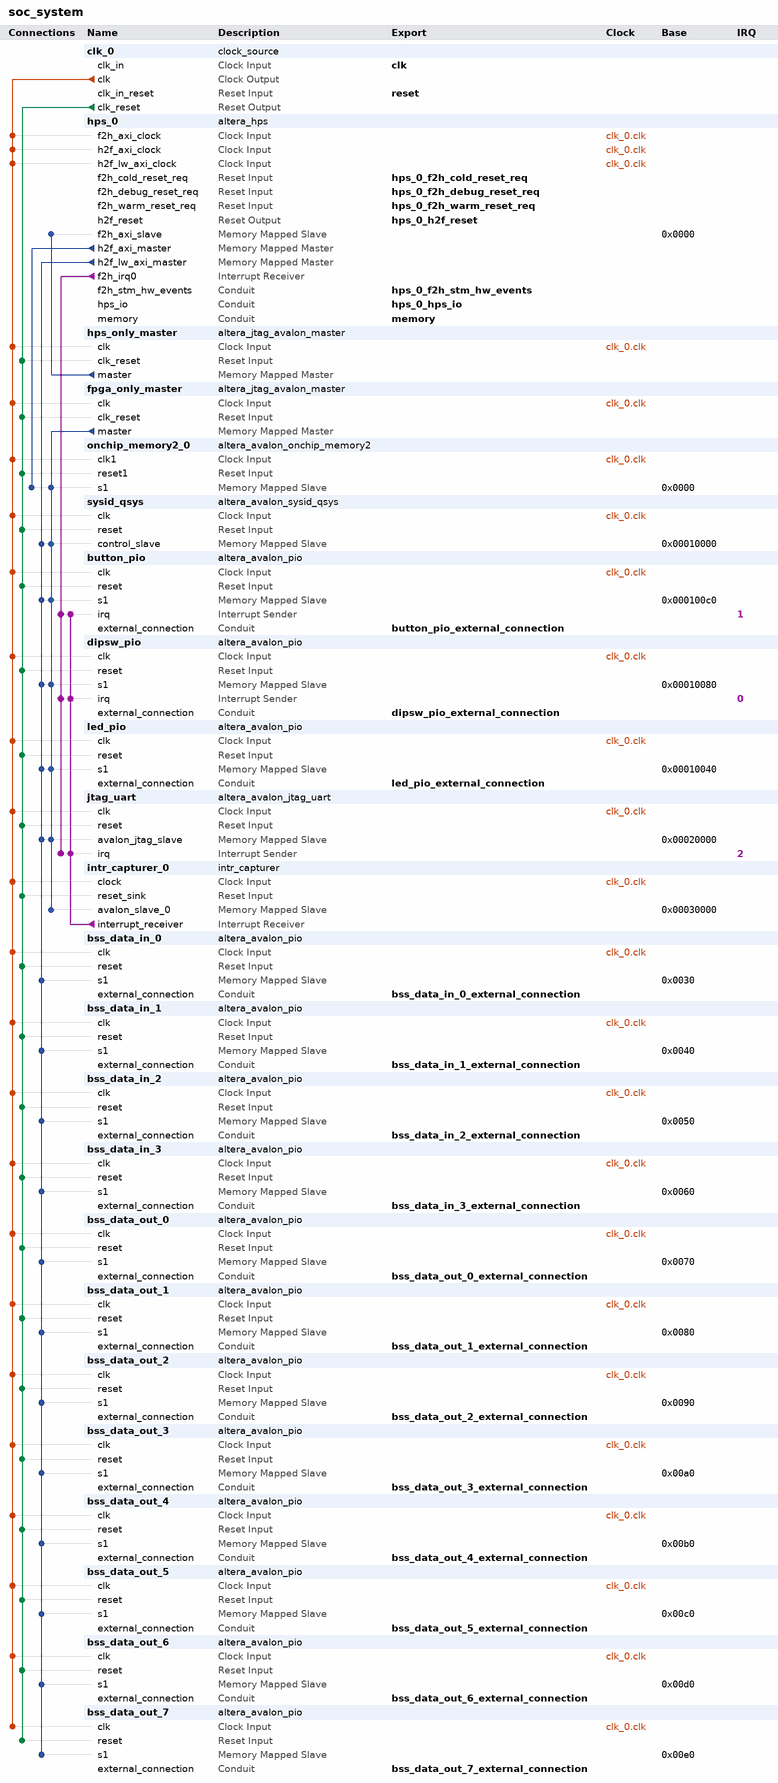
[diagram p0: system contents]
# Platform Designer (Qsys) system soc_system, Cyclone V 5CSEMA4U23C6
# Parameters at their usual value, and those the tool derives, are not listed.
package require -exact qsys 15.1
create_system soc_system
set_project_property DEVICE_FAMILY {Cyclone V}
set_project_property DEVICE 5CSEMA4U23C6

add_instance clk_0 clock_source 15.1
set_instance_parameter_value clk_0 clockFrequency 50000000

add_instance hps_0 altera_hps 15.1
set_instance_parameter_value hps_0 EMAC1_Mode RGMII
set_instance_parameter_value hps_0 EMAC1_PinMuxing {HPS I/O Set 0}
set_instance_parameter_value hps_0 F2SCLK_COLDRST_Enable true
set_instance_parameter_value hps_0 F2SCLK_DBGRST_Enable true
set_instance_parameter_value hps_0 F2SCLK_WARMRST_Enable true
set_instance_parameter_value hps_0 F2SINTERRUPT_Enable true
set_instance_parameter_value hps_0 F2S_Width 3
set_instance_parameter_value hps_0 FPGA_PERIPHERAL_OUTPUT_CLOCK_FREQ_EMAC0_GTX_CLK 100
set_instance_parameter_value hps_0 FPGA_PERIPHERAL_OUTPUT_CLOCK_FREQ_EMAC0_MD_CLK 100.0
set_instance_parameter_value hps_0 FPGA_PERIPHERAL_OUTPUT_CLOCK_FREQ_EMAC1_GTX_CLK 100
set_instance_parameter_value hps_0 FPGA_PERIPHERAL_OUTPUT_CLOCK_FREQ_EMAC1_MD_CLK 100.0
set_instance_parameter_value hps_0 HPS_PROTOCOL DDR3
set_instance_parameter_value hps_0 I2C0_Mode I2C
set_instance_parameter_value hps_0 I2C0_PinMuxing {HPS I/O Set 0}
set_instance_parameter_value hps_0 I2C1_Mode I2C
set_instance_parameter_value hps_0 I2C1_PinMuxing {HPS I/O Set 0}
set_instance_parameter_value hps_0 LWH2F_Enable true
set_instance_parameter_value hps_0 MEM_BANKADDR_WIDTH 3
set_instance_parameter_value hps_0 MEM_CLK_FREQ 400.0
set_instance_parameter_value hps_0 MEM_COL_ADDR_WIDTH 10
set_instance_parameter_value hps_0 MEM_DQ_WIDTH 32
set_instance_parameter_value hps_0 MEM_DRV_STR RZQ/6
set_instance_parameter_value hps_0 MEM_ROW_ADDR_WIDTH 15
set_instance_parameter_value hps_0 MEM_RTT_NOM RZQ/6
set_instance_parameter_value hps_0 MEM_RTT_WR {Dynamic ODT off}
set_instance_parameter_value hps_0 MEM_TCL 7
set_instance_parameter_value hps_0 MEM_TFAW_NS 37.5
set_instance_parameter_value hps_0 MEM_TRAS_NS 35.0
set_instance_parameter_value hps_0 MEM_TRCD_NS 13.75
set_instance_parameter_value hps_0 MEM_TRFC_NS 300.0
set_instance_parameter_value hps_0 MEM_TRP_NS 13.75
set_instance_parameter_value hps_0 MEM_VENDOR Other
set_instance_parameter_value hps_0 MEM_WTCL 7
set_instance_parameter_value hps_0 QSPI_Mode N/A
set_instance_parameter_value hps_0 QSPI_PinMuxing Unused
set_instance_parameter_value hps_0 REF_CLK_FREQ 25.0
set_instance_parameter_value hps_0 S2FCLK_USER2CLK 1
set_instance_parameter_value hps_0 S2F_Width 2
set_instance_parameter_value hps_0 SDIO_Mode {4-bit Data}
set_instance_parameter_value hps_0 SDIO_PinMuxing {HPS I/O Set 0}
set_instance_parameter_value hps_0 SPIM1_Mode {Single Slave Select}
set_instance_parameter_value hps_0 SPIM1_PinMuxing {HPS I/O Set 0}
set_instance_parameter_value hps_0 STM_Enable true
set_instance_parameter_value hps_0 TIMING_BOARD_AC_SKEW 0.02
set_instance_parameter_value hps_0 TIMING_BOARD_AC_TO_CK_SKEW 0.0
set_instance_parameter_value hps_0 TIMING_BOARD_DQ_TO_DQS_SKEW 0.0
set_instance_parameter_value hps_0 TIMING_BOARD_MAX_CK_DELAY 0.6
set_instance_parameter_value hps_0 TIMING_BOARD_MAX_DQS_DELAY 0.6
set_instance_parameter_value hps_0 TIMING_BOARD_SKEW_BETWEEN_DQS 0.02
set_instance_parameter_value hps_0 TIMING_BOARD_SKEW_CKDQS_DIMM_MAX 0.01
set_instance_parameter_value hps_0 TIMING_BOARD_SKEW_CKDQS_DIMM_MIN -0.01
set_instance_parameter_value hps_0 TIMING_BOARD_SKEW_WITHIN_DQS 0.02
set_instance_parameter_value hps_0 TIMING_TDH 125
set_instance_parameter_value hps_0 TIMING_TDQSCK 400
set_instance_parameter_value hps_0 TIMING_TDQSQ 120
set_instance_parameter_value hps_0 TIMING_TDS 50
set_instance_parameter_value hps_0 TIMING_TIH 250
set_instance_parameter_value hps_0 TIMING_TIS 175
set_instance_parameter_value hps_0 TIMING_TQSH 0.38
set_instance_parameter_value hps_0 UART0_Mode {No Flow Control}
set_instance_parameter_value hps_0 UART0_PinMuxing {HPS I/O Set 0}
set_instance_parameter_value hps_0 USB1_Mode SDR
set_instance_parameter_value hps_0 USB1_PinMuxing {HPS I/O Set 0}
set_instance_parameter_value hps_0 desired_cfg_clk_mhz 100.0
set_instance_parameter_value hps_0 desired_qspi_clk_mhz 370.0

add_instance hps_only_master altera_jtag_avalon_master 15.1

add_instance fpga_only_master altera_jtag_avalon_master 15.1

add_instance onchip_memory2_0 altera_avalon_onchip_memory2 15.1
set_instance_parameter_value onchip_memory2_0 dataWidth 64
set_instance_parameter_value onchip_memory2_0 dualPort false
set_instance_parameter_value onchip_memory2_0 initMemContent true
set_instance_parameter_value onchip_memory2_0 initializationFileName onchip_memory2_0
set_instance_parameter_value onchip_memory2_0 memorySize 65536

add_instance sysid_qsys altera_avalon_sysid_qsys 15.1
set_instance_parameter_value sysid_qsys id -1395322110

add_instance button_pio altera_avalon_pio 15.1
set_instance_parameter_value button_pio bitClearingEdgeCapReg true
set_instance_parameter_value button_pio captureEdge true
set_instance_parameter_value button_pio direction Input
set_instance_parameter_value button_pio edgeType FALLING
set_instance_parameter_value button_pio generateIRQ true
set_instance_parameter_value button_pio irqType EDGE
set_instance_parameter_value button_pio width 4

add_instance dipsw_pio altera_avalon_pio 15.1
set_instance_parameter_value dipsw_pio bitClearingEdgeCapReg true
set_instance_parameter_value dipsw_pio captureEdge true
set_instance_parameter_value dipsw_pio direction Input
set_instance_parameter_value dipsw_pio edgeType ANY
set_instance_parameter_value dipsw_pio generateIRQ true
set_instance_parameter_value dipsw_pio irqType EDGE
set_instance_parameter_value dipsw_pio width 4

add_instance led_pio altera_avalon_pio 15.1
set_instance_parameter_value led_pio direction Output
set_instance_parameter_value led_pio width 8

add_instance jtag_uart altera_avalon_jtag_uart 15.1
set_instance_parameter_value jtag_uart allowMultipleConnections true
set_instance_parameter_value jtag_uart simInteractiveOptions INTERACTIVE_ASCII_OUTPUT

add_instance intr_capturer_0 intr_capturer 100.99.98.97

add_instance bss_data_in_0 altera_avalon_pio 15.1
set_instance_parameter_value bss_data_in_0 direction Output
set_instance_parameter_value bss_data_in_0 width 32

add_instance bss_data_in_1 altera_avalon_pio 15.1
set_instance_parameter_value bss_data_in_1 direction Output
set_instance_parameter_value bss_data_in_1 width 32

add_instance bss_data_in_2 altera_avalon_pio 15.1
set_instance_parameter_value bss_data_in_2 direction Output
set_instance_parameter_value bss_data_in_2 width 32

add_instance bss_data_in_3 altera_avalon_pio 15.1
set_instance_parameter_value bss_data_in_3 direction Output
set_instance_parameter_value bss_data_in_3 width 32

add_instance bss_data_out_0 altera_avalon_pio 15.1
set_instance_parameter_value bss_data_out_0 direction Input
set_instance_parameter_value bss_data_out_0 width 32

add_instance bss_data_out_1 altera_avalon_pio 15.1
set_instance_parameter_value bss_data_out_1 direction Input
set_instance_parameter_value bss_data_out_1 width 32

add_instance bss_data_out_2 altera_avalon_pio 15.1
set_instance_parameter_value bss_data_out_2 direction Input
set_instance_parameter_value bss_data_out_2 width 32

add_instance bss_data_out_3 altera_avalon_pio 15.1
set_instance_parameter_value bss_data_out_3 direction Input
set_instance_parameter_value bss_data_out_3 width 32

add_instance bss_data_out_4 altera_avalon_pio 15.1
set_instance_parameter_value bss_data_out_4 direction Input
set_instance_parameter_value bss_data_out_4 width 32

add_instance bss_data_out_5 altera_avalon_pio 15.1
set_instance_parameter_value bss_data_out_5 direction Input
set_instance_parameter_value bss_data_out_5 width 32

add_instance bss_data_out_6 altera_avalon_pio 15.1
set_instance_parameter_value bss_data_out_6 direction Input
set_instance_parameter_value bss_data_out_6 width 32

add_instance bss_data_out_7 altera_avalon_pio 15.1
set_instance_parameter_value bss_data_out_7 direction Input
set_instance_parameter_value bss_data_out_7 width 32

# connections
add_connection clk_0.clk bss_data_in_0.clk clock
add_connection clk_0.clk bss_data_in_1.clk clock
add_connection clk_0.clk bss_data_in_2.clk clock
add_connection clk_0.clk bss_data_in_3.clk clock
add_connection clk_0.clk bss_data_out_0.clk clock
add_connection clk_0.clk bss_data_out_1.clk clock
add_connection clk_0.clk bss_data_out_2.clk clock
add_connection clk_0.clk bss_data_out_3.clk clock
add_connection clk_0.clk bss_data_out_4.clk clock
add_connection clk_0.clk bss_data_out_5.clk clock
add_connection clk_0.clk bss_data_out_6.clk clock
add_connection clk_0.clk bss_data_out_7.clk clock
add_connection clk_0.clk button_pio.clk clock
add_connection clk_0.clk dipsw_pio.clk clock
add_connection clk_0.clk fpga_only_master.clk clock
add_connection clk_0.clk hps_0.f2h_axi_clock clock
add_connection clk_0.clk hps_0.h2f_axi_clock clock
add_connection clk_0.clk hps_0.h2f_lw_axi_clock clock
add_connection clk_0.clk hps_only_master.clk clock
add_connection clk_0.clk intr_capturer_0.clock clock
add_connection clk_0.clk jtag_uart.clk clock
add_connection clk_0.clk led_pio.clk clock
add_connection clk_0.clk onchip_memory2_0.clk1 clock
add_connection clk_0.clk sysid_qsys.clk clock
add_connection clk_0.clk_reset bss_data_in_0.reset reset
add_connection clk_0.clk_reset bss_data_in_1.reset reset
add_connection clk_0.clk_reset bss_data_in_2.reset reset
add_connection clk_0.clk_reset bss_data_in_3.reset reset
add_connection clk_0.clk_reset bss_data_out_0.reset reset
add_connection clk_0.clk_reset bss_data_out_1.reset reset
add_connection clk_0.clk_reset bss_data_out_2.reset reset
add_connection clk_0.clk_reset bss_data_out_3.reset reset
add_connection clk_0.clk_reset bss_data_out_4.reset reset
add_connection clk_0.clk_reset bss_data_out_5.reset reset
add_connection clk_0.clk_reset bss_data_out_6.reset reset
add_connection clk_0.clk_reset bss_data_out_7.reset reset
add_connection clk_0.clk_reset button_pio.reset reset
add_connection clk_0.clk_reset dipsw_pio.reset reset
add_connection clk_0.clk_reset fpga_only_master.clk_reset reset
add_connection clk_0.clk_reset hps_only_master.clk_reset reset
add_connection clk_0.clk_reset intr_capturer_0.reset_sink reset
add_connection clk_0.clk_reset jtag_uart.reset reset
add_connection clk_0.clk_reset led_pio.reset reset
add_connection clk_0.clk_reset onchip_memory2_0.reset1 reset
add_connection clk_0.clk_reset sysid_qsys.reset reset
add_connection fpga_only_master.master button_pio.s1 avalon
set_connection_parameter_value fpga_only_master.master/button_pio.s1 baseAddress 0x000100c0
add_connection fpga_only_master.master dipsw_pio.s1 avalon
set_connection_parameter_value fpga_only_master.master/dipsw_pio.s1 baseAddress 0x00010080
add_connection fpga_only_master.master intr_capturer_0.avalon_slave_0 avalon
set_connection_parameter_value fpga_only_master.master/intr_capturer_0.avalon_slave_0 baseAddress 0x00030000
add_connection fpga_only_master.master jtag_uart.avalon_jtag_slave avalon
set_connection_parameter_value fpga_only_master.master/jtag_uart.avalon_jtag_slave baseAddress 0x00020000
add_connection fpga_only_master.master led_pio.s1 avalon
set_connection_parameter_value fpga_only_master.master/led_pio.s1 baseAddress 0x00010040
add_connection fpga_only_master.master onchip_memory2_0.s1 avalon
set_connection_parameter_value fpga_only_master.master/onchip_memory2_0.s1 baseAddress 0x0000
add_connection fpga_only_master.master sysid_qsys.control_slave avalon
set_connection_parameter_value fpga_only_master.master/sysid_qsys.control_slave baseAddress 0x00010000
add_connection hps_0.h2f_axi_master onchip_memory2_0.s1 avalon
set_connection_parameter_value hps_0.h2f_axi_master/onchip_memory2_0.s1 baseAddress 0x0000
add_connection hps_0.h2f_lw_axi_master bss_data_in_0.s1 avalon
set_connection_parameter_value hps_0.h2f_lw_axi_master/bss_data_in_0.s1 baseAddress 0x0030
add_connection hps_0.h2f_lw_axi_master bss_data_in_1.s1 avalon
set_connection_parameter_value hps_0.h2f_lw_axi_master/bss_data_in_1.s1 baseAddress 0x0040
add_connection hps_0.h2f_lw_axi_master bss_data_in_2.s1 avalon
set_connection_parameter_value hps_0.h2f_lw_axi_master/bss_data_in_2.s1 baseAddress 0x0050
add_connection hps_0.h2f_lw_axi_master bss_data_in_3.s1 avalon
set_connection_parameter_value hps_0.h2f_lw_axi_master/bss_data_in_3.s1 baseAddress 0x0060
add_connection hps_0.h2f_lw_axi_master bss_data_out_0.s1 avalon
set_connection_parameter_value hps_0.h2f_lw_axi_master/bss_data_out_0.s1 baseAddress 0x0070
add_connection hps_0.h2f_lw_axi_master bss_data_out_1.s1 avalon
set_connection_parameter_value hps_0.h2f_lw_axi_master/bss_data_out_1.s1 baseAddress 0x0080
add_connection hps_0.h2f_lw_axi_master bss_data_out_2.s1 avalon
set_connection_parameter_value hps_0.h2f_lw_axi_master/bss_data_out_2.s1 baseAddress 0x0090
add_connection hps_0.h2f_lw_axi_master bss_data_out_3.s1 avalon
set_connection_parameter_value hps_0.h2f_lw_axi_master/bss_data_out_3.s1 baseAddress 0x00a0
add_connection hps_0.h2f_lw_axi_master bss_data_out_4.s1 avalon
set_connection_parameter_value hps_0.h2f_lw_axi_master/bss_data_out_4.s1 baseAddress 0x00b0
add_connection hps_0.h2f_lw_axi_master bss_data_out_5.s1 avalon
set_connection_parameter_value hps_0.h2f_lw_axi_master/bss_data_out_5.s1 baseAddress 0x00c0
add_connection hps_0.h2f_lw_axi_master bss_data_out_6.s1 avalon
set_connection_parameter_value hps_0.h2f_lw_axi_master/bss_data_out_6.s1 baseAddress 0x00d0
add_connection hps_0.h2f_lw_axi_master bss_data_out_7.s1 avalon
set_connection_parameter_value hps_0.h2f_lw_axi_master/bss_data_out_7.s1 baseAddress 0x00e0
add_connection hps_0.h2f_lw_axi_master button_pio.s1 avalon
set_connection_parameter_value hps_0.h2f_lw_axi_master/button_pio.s1 baseAddress 0x000100c0
add_connection hps_0.h2f_lw_axi_master dipsw_pio.s1 avalon
set_connection_parameter_value hps_0.h2f_lw_axi_master/dipsw_pio.s1 baseAddress 0x00010080
add_connection hps_0.h2f_lw_axi_master jtag_uart.avalon_jtag_slave avalon
set_connection_parameter_value hps_0.h2f_lw_axi_master/jtag_uart.avalon_jtag_slave baseAddress 0x00020000
add_connection hps_0.h2f_lw_axi_master led_pio.s1 avalon
set_connection_parameter_value hps_0.h2f_lw_axi_master/led_pio.s1 baseAddress 0x00010040
add_connection hps_0.h2f_lw_axi_master sysid_qsys.control_slave avalon
set_connection_parameter_value hps_0.h2f_lw_axi_master/sysid_qsys.control_slave baseAddress 0x00010000
add_connection hps_only_master.master hps_0.f2h_axi_slave avalon
set_connection_parameter_value hps_only_master.master/hps_0.f2h_axi_slave baseAddress 0x0000
add_connection hps_0.f2h_irq0 button_pio.irq interrupt
set_connection_parameter_value hps_0.f2h_irq0/button_pio.irq irqNumber 1
add_connection hps_0.f2h_irq0 dipsw_pio.irq interrupt
set_connection_parameter_value hps_0.f2h_irq0/dipsw_pio.irq irqNumber 0
add_connection hps_0.f2h_irq0 jtag_uart.irq interrupt
set_connection_parameter_value hps_0.f2h_irq0/jtag_uart.irq irqNumber 2
add_connection intr_capturer_0.interrupt_receiver button_pio.irq interrupt
set_connection_parameter_value intr_capturer_0.interrupt_receiver/button_pio.irq irqNumber 1
add_connection intr_capturer_0.interrupt_receiver dipsw_pio.irq interrupt
set_connection_parameter_value intr_capturer_0.interrupt_receiver/dipsw_pio.irq irqNumber 0
add_connection intr_capturer_0.interrupt_receiver jtag_uart.irq interrupt
set_connection_parameter_value intr_capturer_0.interrupt_receiver/jtag_uart.irq irqNumber 2

# exported interfaces
add_interface bss_data_in_0_external_connection conduit end
set_interface_property bss_data_in_0_external_connection EXPORT_OF bss_data_in_0.external_connection
add_interface bss_data_in_1_external_connection conduit end
set_interface_property bss_data_in_1_external_connection EXPORT_OF bss_data_in_1.external_connection
add_interface bss_data_in_2_external_connection conduit end
set_interface_property bss_data_in_2_external_connection EXPORT_OF bss_data_in_2.external_connection
add_interface bss_data_in_3_external_connection conduit end
set_interface_property bss_data_in_3_external_connection EXPORT_OF bss_data_in_3.external_connection
add_interface bss_data_out_0_external_connection conduit end
set_interface_property bss_data_out_0_external_connection EXPORT_OF bss_data_out_0.external_connection
add_interface bss_data_out_1_external_connection conduit end
set_interface_property bss_data_out_1_external_connection EXPORT_OF bss_data_out_1.external_connection
add_interface bss_data_out_2_external_connection conduit end
set_interface_property bss_data_out_2_external_connection EXPORT_OF bss_data_out_2.external_connection
add_interface bss_data_out_3_external_connection conduit end
set_interface_property bss_data_out_3_external_connection EXPORT_OF bss_data_out_3.external_connection
add_interface bss_data_out_4_external_connection conduit end
set_interface_property bss_data_out_4_external_connection EXPORT_OF bss_data_out_4.external_connection
add_interface bss_data_out_5_external_connection conduit end
set_interface_property bss_data_out_5_external_connection EXPORT_OF bss_data_out_5.external_connection
add_interface bss_data_out_6_external_connection conduit end
set_interface_property bss_data_out_6_external_connection EXPORT_OF bss_data_out_6.external_connection
add_interface bss_data_out_7_external_connection conduit end
set_interface_property bss_data_out_7_external_connection EXPORT_OF bss_data_out_7.external_connection
add_interface button_pio_external_connection conduit end
set_interface_property button_pio_external_connection EXPORT_OF button_pio.external_connection
add_interface clk clock sink
set_interface_property clk EXPORT_OF clk_0.clk_in
add_interface dipsw_pio_external_connection conduit end
set_interface_property dipsw_pio_external_connection EXPORT_OF dipsw_pio.external_connection
add_interface hps_0_f2h_cold_reset_req reset sink
set_interface_property hps_0_f2h_cold_reset_req EXPORT_OF hps_0.f2h_cold_reset_req
add_interface hps_0_f2h_debug_reset_req reset sink
set_interface_property hps_0_f2h_debug_reset_req EXPORT_OF hps_0.f2h_debug_reset_req
add_interface hps_0_f2h_stm_hw_events conduit end
set_interface_property hps_0_f2h_stm_hw_events EXPORT_OF hps_0.f2h_stm_hw_events
add_interface hps_0_f2h_warm_reset_req reset sink
set_interface_property hps_0_f2h_warm_reset_req EXPORT_OF hps_0.f2h_warm_reset_req
add_interface hps_0_h2f_reset reset source
set_interface_property hps_0_h2f_reset EXPORT_OF hps_0.h2f_reset
add_interface hps_0_hps_io conduit end
set_interface_property hps_0_hps_io EXPORT_OF hps_0.hps_io
add_interface led_pio_external_connection conduit end
set_interface_property led_pio_external_connection EXPORT_OF led_pio.external_connection
add_interface memory conduit end
set_interface_property memory EXPORT_OF hps_0.memory
add_interface reset reset sink
set_interface_property reset EXPORT_OF clk_0.clk_in_reset

set_interconnect_requirement {$system} qsys_mm.clockCrossingAdapter HANDSHAKE
set_interconnect_requirement {$system} qsys_mm.maxAdditionalLatency 1

save_system soc_system.qsys
